# Altium schematic sheet 04-蜂鸣器.SchDoc
size A4; DocumentNumber: 25; SheetNumber: 25; SheetTotal: 34
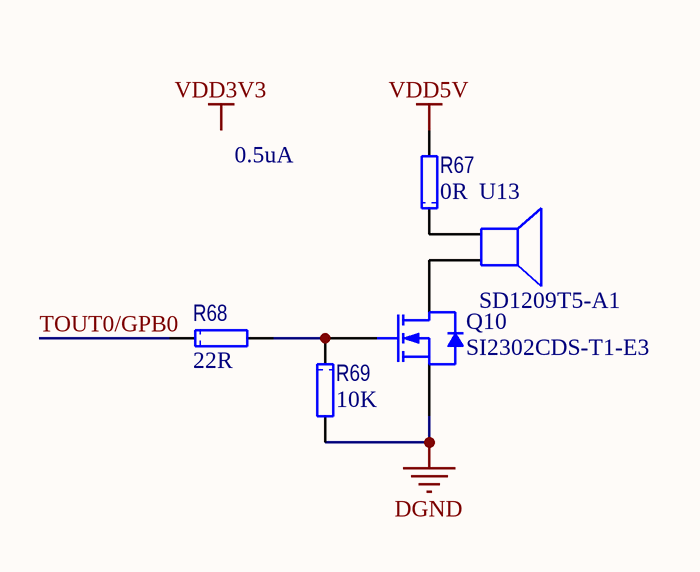
[diagram p0: 04-蜂鸣器.SchDoc]

## Parts
Q10  SI2302CDS-T1-E3  [SOT23_N]
R67  value 0R  [1608[0603]R]  (hidden comment: CRCW06030000ZSTA)
R68  value 22R  [1608[0603]R]  (hidden comment: CRCW060322R0FKEA)
R69  value 10K  [1608[0603]R]  (hidden comment: CRCW060310K0FKEA)
U13  SD1209T5-A1  [Speaker]

## Nets
DGND: Q10.2(S) R69.2
VDD5V: R67.2
TOUT0/GPB0: R68.1
NetQ10_1: Q10.1(G) R68.2 R69.1
NetQ10_3: Q10.3(D) U13.2
NetR67_1: R67.1 U13.1

## Notes on the sheet
- 0.5uA
- Labels drawn without touching a wire or pin: VDD3V3

## Library data of the parts
Q10 = 2N7002: MOSFET 20V 2.9A 0.86W 57mohm @ 4.5V; Manufacturer: Vishay / Siliconix; 配置: Single; 封装 / 箱体: SOT-23-3; 封装: Reel; 漏极连续电流: 2.6 A; 闸/源击穿电压: +/- 8 V; 安装风格: SMD/SMT; 功率耗散: 710 mW; 电阻汲极/源极 RDS（导通）: 0.057 Ohms; 晶体管极性: N-Channel; 下降时间: 7 ns; 制造商: Vishay; 最大工作温度: + 150 C; 最小工作温度: - 55 C; 产品种类: N-Channel MOSFETs; 标准包装数量: 3000; 典型关闭延迟时间: 30 ns; Supplier 1: Mouser; Supplier Part Number 1: 781-SI2302CDS-E3; Manufacturer Part Number: SI2302CDS-T1-E3; RoHS: RoHS Compliant; Description 1: MOSFET 20V 2.9A 0.86W 57mohm @ 4.5V; Category: MOSFET; Stock 1: 51301; Pricing 1: 1=0.150, 10=0.140, 100=0.130, 250=0.125, 500=0.120, 1000=0.115, 3000=0.110, 6000=0.105, 12000=0.100 (USD); 汲极/源极击穿电压: 20 V; 上升时间: 7 ns; RoHS - 贸泽: Y; Minimum Order Quantity: 1; Reeling: True; ComponentLink1URL: http://www.vishay.com/doc?68645; ComponentLink1Description: http://www.vishay.com/doc?68645
R67 = RES: 厚膜电阻器 - SMD 1/10watt ZEROohm Jumper; Manufacturer: Vishay / Dale; 尺寸: 0.85 mm W x 1.55 mm L x 0.45 mm H; 工作温度范围: - 55 C to + 155 C; 封装 / 箱体: 0603 (1608 metric); 封装: Reel; 功率额定值: 100 mW; 产品: Thick Film Resistors Zero-Ohm; 电阻: 0 Ohms; 系列: CRCW; 温度系数: 200 PPM / C; 端接类型: SMD/SMT; 容差: 1 %; 电压额定值: 75 V; 外壳代码 - in: 0603; 外壳代码 - mm: 1608; 制造商: Vishay; 产品种类: 0603 Thick Film Chip Resistors; 标准包装数量: 5000; Supplier 1: Mouser; Supplier Part Number 1: 71-CRCW0603-0; Manufacturer Part Number: CRCW06030000ZSTA; RoHS: No; Category: 厚膜电阻器 - SMD; Stock 1: 44945; Pricing 1: 1=0.110, 10=0.064, 100=0.036, 1000=0.024, 5000=0.010, 10000=0.009, 25000=0.008, 50000=0.006 (USD); RoHS - 贸泽: N; Minimum Order Quantity: 1; Reeling: True; ComponentLink1URL: http://www.mouser.com/ds/2/427/dcrcw-72725.pdf; ComponentLink1Description: http://www.mouser.com/ds/2/427/dcrcw-72725.pdf; Description 1: 厚膜电阻器 - SMD 1/10watt ZEROohm Jumper
R68 = RES: 厚膜电阻器 - SMD 1/10watt 22ohms 1%; Manufacturer: Vishay / Dale; 尺寸: 0.85 mm W x 1.55 mm L x 0.45 mm H; 工作温度范围: - 55 C to + 155 C; 封装 / 箱体: 0603 (1608 metric); 封装: Reel; 功率额定值: 100 mW; 产品: Thick Film Resistors SMD; 系列: CRCW; 温度系数: 100 PPM / K; 端接类型: SMD/SMT; 电压额定值: 75 V; 制造商: Vishay; 标准包装数量: 5000; 外壳代码 - in: 0603; 外壳代码 - mm: 1608; 产品种类: 0603 Thick Film Chip Resistors; Supplier 1: Mouser; Supplier Part Number 1: 71-CRCW0603-22-E3; Manufacturer Part Number: CRCW060322R0FKEA; RoHS: RoHS Compliant By Exemption; Category: 厚膜电阻器 - SMD; Stock 1: 35802; 电阻: 22 Ohms; 容差: 1 %; Minimum Order Quantity: 1; Reeling: True; ComponentLink1URL: http://www.mouser.com/ds/2/427/dcrcwe3-109170.pdf; ComponentLink1Description: http://www.mouser.com/ds/2/427/dcrcwe3-109170.pdf; Description 1: 厚膜电阻器 - SMD 1/10watt 22ohms 1%; Pricing 1: 1=0.080, 10=0.013, 100=0.010, 1000=0.008, 5000=0.005, 25000=0.004, 50000=0.003 (USD); RoHS - 贸泽: E
R69 = RES: 厚膜电阻器 - SMD 1/10watt 10Kohms 1%; Manufacturer: Vishay / Dale; 尺寸: 0.85 mm W x 1.55 mm L x 0.45 mm H; 工作温度范围: - 55 C to + 155 C; 封装 / 箱体: 0603 (1608 metric); 封装: Reel; 功率额定值: 100 mW; 产品: Thick Film Resistors SMD; 系列: CRCW; 温度系数: 100 PPM / K; 端接类型: SMD/SMT; 电压额定值: 75 V; 制造商: Vishay; 产品种类: 0603 Thick Film Chip Resistors; 标准包装数量: 5000; 外壳代码 - in: 0603; 外壳代码 - mm: 1608; Supplier 1: Mouser; Supplier Part Number 1: 71-CRCW0603-10K-E3; Manufacturer Part Number: CRCW060310K0FKEA; RoHS: RoHS Compliant By Exemption; Category: 厚膜电阻器 - SMD; Stock 1: 0; Pricing 1: 1=0.080, 10=0.013, 100=0.010, 1000=0.008, 5000=0.005, 25000=0.004, 50000=0.003 (USD); 电阻: 10 kOhms; 容差: 1 %; RoHS - 贸泽: E; Minimum Order Quantity: 1; Reeling: True; ComponentLink1URL: http://www.mouser.com/ds/2/427/dcrcwe3-109170.pdf; ComponentLink1Description: http://www.mouser.com/ds/2/427/dcrcwe3-109170.pdf; Description 1: 厚膜电阻器 - SMD 1/10watt 10Kohms 1%
U13 = SPEAKER: 插针 BUZZER MAGNET 2048HZ 12MM PC MNT; Manufacturer: TDK Corporation; Manufacturer Part Number: SD1209T3-A1; Driver Circuitry: Transducer, Externally Driven; Input Type: zero-peak Signal; Voltage - Rated: 3Vo-p; Voltage Range: 1 ~ 4V; Frequency: 2.048kHz; Operating Mode: Continuous; Sound Pressure Level: 89dB @ 3V, 10cm; Current - Supply: 60mA; Washable: No; Supplier 1: Digi-Key; Supplier Part Number 1: 445-2530-ND; RoHS: RoHS Compliant; Description 1: BUZZER MAGNET 2048HZ 12MM PC MNT; Category: Audio Products; Stock 1: 1229; Pricing 1: 1=1.98, 10=1.726, 100=1.0869, 250=1.05496, 500=1.023, 1000=0.9271, 5000=0.83119, 10000=0.81521 (USD); Packaging: Tray; Technology: Magnetic; Mounting Type: Through Hole; Termination: PC Pins; Size / Dimension: Circular - 12.00mm Dia x 9.00mm H; Capacitance @ Frequency: -; Operating Temperature: -40°C ~ 85°C; ComponentLink1URL: http://www.tdk.co.jp/tefe02/ec211_sd.pdf; ComponentLink1Description: http://www.tdk.co.jp/tefe02/ec211_sd.pdf